# EAGLE design ElectronPhotonTopBoard (EAGLE 7.4.0)
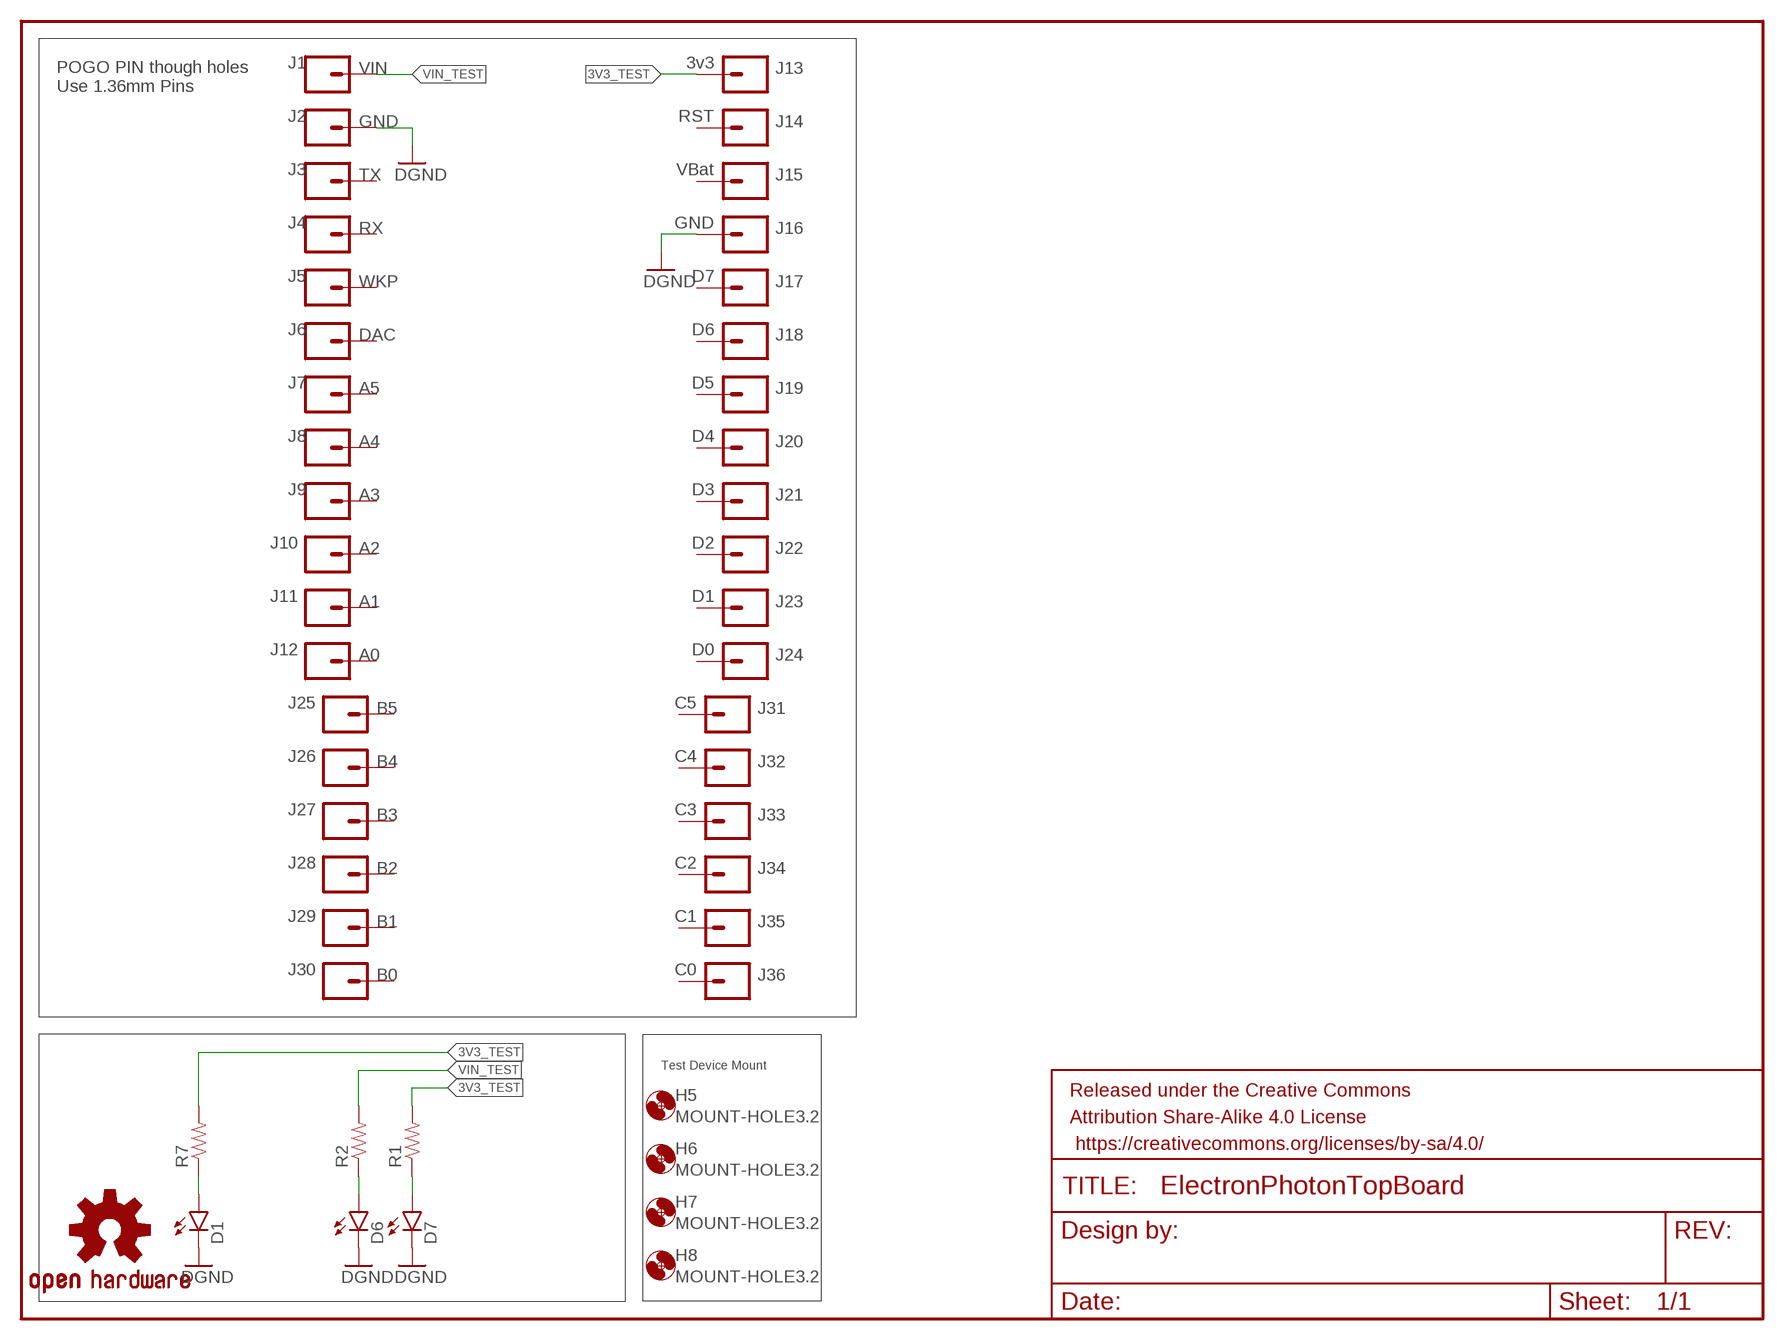
[diagram p0: schematic, sheet 1]

## Parts
D1  LED1206-BOTTOM  [LED-1206-BOTTOM]
D6  LED1206-BOTTOM  [LED-1206-BOTTOM]
D7  LED1206-BOTTOM  [LED-1206-BOTTOM]
FRAME1  FRAME-LETTER  [CREATIVE_COMMONS]
H5  MOUNT-HOLE3.2  [3,2]
H6  MOUNT-HOLE3.2  [3,2]
H7  MOUNT-HOLE3.2  [3,2]
H8  MOUNT-HOLE3.2  [3,2]
J1  VIN  M01-CUSTOMPOGOPIN_HOLE_1.4  [1X01_POGOPIN_HOLE_1.4]
J2  GND  M01-CUSTOMPOGOPIN_HOLE_1.4  [1X01_POGOPIN_HOLE_1.4]
J3  TX  M01-CUSTOMPOGOPIN_HOLE_1.4  [1X01_POGOPIN_HOLE_1.4]
J4  RX  M01-CUSTOMPOGOPIN_HOLE_1.4  [1X01_POGOPIN_HOLE_1.4]
J5  WKP  M01-CUSTOMPOGOPIN_HOLE_1.4  [1X01_POGOPIN_HOLE_1.4]
J6  DAC  M01-CUSTOMPOGOPIN_HOLE_1.4  [1X01_POGOPIN_HOLE_1.4]
J7  A5  M01-CUSTOMPOGOPIN_HOLE_1.4  [1X01_POGOPIN_HOLE_1.4]
J8  A4  M01-CUSTOMPOGOPIN_HOLE_1.4  [1X01_POGOPIN_HOLE_1.4]
J9  A3  M01-CUSTOMPOGOPIN_HOLE_1.4  [1X01_POGOPIN_HOLE_1.4]
J10  A2  M01-CUSTOMPOGOPIN_HOLE_1.4  [1X01_POGOPIN_HOLE_1.4]
J11  A1  M01-CUSTOMPOGOPIN_HOLE_1.4  [1X01_POGOPIN_HOLE_1.4]
J12  A0  M01-CUSTOMPOGOPIN_HOLE_1.4  [1X01_POGOPIN_HOLE_1.4]
J13  3v3  M01-CUSTOMPOGOPIN_HOLE_1.4  [1X01_POGOPIN_HOLE_1.4]
J14  RST  M01-CUSTOMPOGOPIN_HOLE_1.4  [1X01_POGOPIN_HOLE_1.4]
J15  VBat  M01-CUSTOMPOGOPIN_HOLE_1.4  [1X01_POGOPIN_HOLE_1.4]
J16  GND  M01-CUSTOMPOGOPIN_HOLE_1.4  [1X01_POGOPIN_HOLE_1.4]
J17  D7  M01-CUSTOMPOGOPIN_HOLE_1.4  [1X01_POGOPIN_HOLE_1.4]
J18  D6  M01-CUSTOMPOGOPIN_HOLE_1.4  [1X01_POGOPIN_HOLE_1.4]
J19  D5  M01-CUSTOMPOGOPIN_HOLE_1.4  [1X01_POGOPIN_HOLE_1.4]
J20  D4  M01-CUSTOMPOGOPIN_HOLE_1.4  [1X01_POGOPIN_HOLE_1.4]
J21  D3  M01-CUSTOMPOGOPIN_HOLE_1.4  [1X01_POGOPIN_HOLE_1.4]
J22  D2  M01-CUSTOMPOGOPIN_HOLE_1.4  [1X01_POGOPIN_HOLE_1.4]
J23  D1  M01-CUSTOMPOGOPIN_HOLE_1.4  [1X01_POGOPIN_HOLE_1.4]
J24  D0  M01-CUSTOMPOGOPIN_HOLE_1.4  [1X01_POGOPIN_HOLE_1.4]
J25  B5  M01-CUSTOMPOGOPIN_HOLE_1.4  [1X01_POGOPIN_HOLE_1.4]
J26  B4  M01-CUSTOMPOGOPIN_HOLE_1.4  [1X01_POGOPIN_HOLE_1.4]
J27  B3  M01-CUSTOMPOGOPIN_HOLE_1.4  [1X01_POGOPIN_HOLE_1.4]
J28  B2  M01-CUSTOMPOGOPIN_HOLE_1.4  [1X01_POGOPIN_HOLE_1.4]
J29  B1  M01-CUSTOMPOGOPIN_HOLE_1.4  [1X01_POGOPIN_HOLE_1.4]
J30  B0  M01-CUSTOMPOGOPIN_HOLE_1.4  [1X01_POGOPIN_HOLE_1.4]
J31  C5  M01-CUSTOMPOGOPIN_HOLE_1.4  [1X01_POGOPIN_HOLE_1.4]
J32  C4  M01-CUSTOMPOGOPIN_HOLE_1.4  [1X01_POGOPIN_HOLE_1.4]
J33  C3  M01-CUSTOMPOGOPIN_HOLE_1.4  [1X01_POGOPIN_HOLE_1.4]
J34  C2  M01-CUSTOMPOGOPIN_HOLE_1.4  [1X01_POGOPIN_HOLE_1.4]
J35  C1  M01-CUSTOMPOGOPIN_HOLE_1.4  [1X01_POGOPIN_HOLE_1.4]
J36  C0  M01-CUSTOMPOGOPIN_HOLE_1.4  [1X01_POGOPIN_HOLE_1.4]
LOGO1  OSHW-LOGOL  [OSHW-LOGO-L]
R1  RESISTOR1206  [1206]
R2  RESISTOR1206  [1206]
R7  RESISTOR1206  [1206]

## Nets
3V3_TEST: J13.1 R1.2 R7.2
GND: D1.C D6.C D7.C J2.1 J16.1 ; supply symbol labelled DGND
N$13: D1.A R7.1
N$18: D6.A R2.1
N$19: D7.A R1.1
VIN_TEST: J1.1 R2.2
Unconnected: J3.1 J4.1 J5.1 J6.1 J7.1 J8.1 J9.1 J10.1 J11.1 J12.1 J14.1 J15.1 J17.1 J18.1 J19.1 J20.1 J21.1 J22.1 J23.1 J24.1 J25.1 J26.1 J27.1 J28.1 J29.1 J30.1 J31.1 J32.1 J33.1 J34.1 J35.1 J36.1

## Notes on the sheet
- POGO PIN though holes
  Use 1.36mm Pins
- Test Device Mount

## Library data of the parts
D1 D6 D7 = SparkFun-LED:LED: LEDs Standard schematic elements and footprints for 5mm, 3mm, 1206, and 0603 sized LEDs. 5mm - Spark Fun Electronics SKU : COM-00529 (and others)
FRAME1 = SparkFun-Aesthetics:FRAME-LETTER: Schematic Frame Standard 8.5x11 US Letter frame
H5-H8 = holes:MOUNT-HOLE: MOUNTING HOLE with drill center marker
J1-J36 = Tinamous:M01-CUSTOM: Header 1 Standard 1-pin 0.1" header. Use with straight break away headers (SKU : PRT-00116), right angle break away headers (PRT-00553), swiss pins (PRT-00743), machine pins (PRT-00117), and female headers (PRT-00115). SMTSO-256-ET is a "flush mount" nut for a 4-40 screw. The older package used to be too tight, and did not allow it to sit properly thru the drill hit. The latest (0.165DIA) fits nice and snug.
LOGO1 = SparkFun-Aesthetics:OSHW-LOGO: Open Source Hardware Logo This logo indicates the piece of hardware it is found on incorporates a OSHW license and/or adheres to the definition of open source hardware found here: http://freedomdefined.org/OSHW
R1 R2 R7 = SparkFun-Resistors:RESISTOR: Resistor Basic schematic elements and footprints for 0603, 1206, and PTH resistors.

## Board
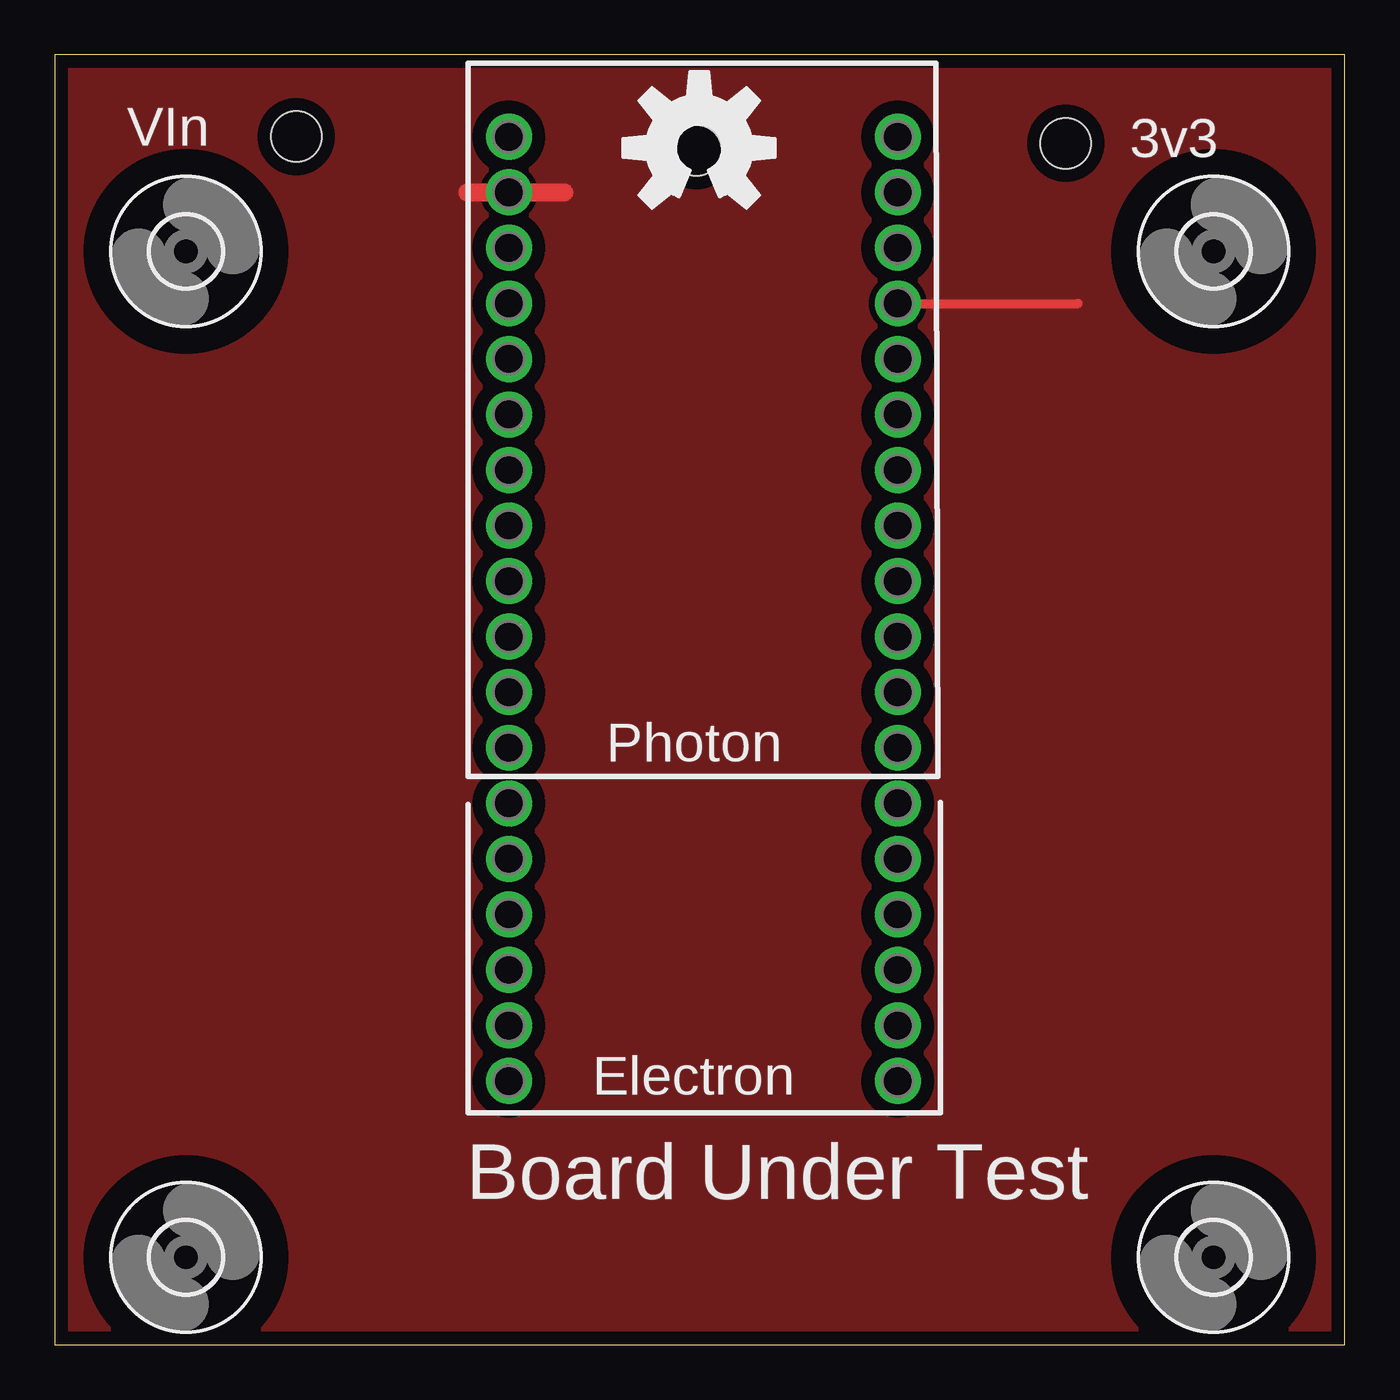
[diagram p1: board, top side]
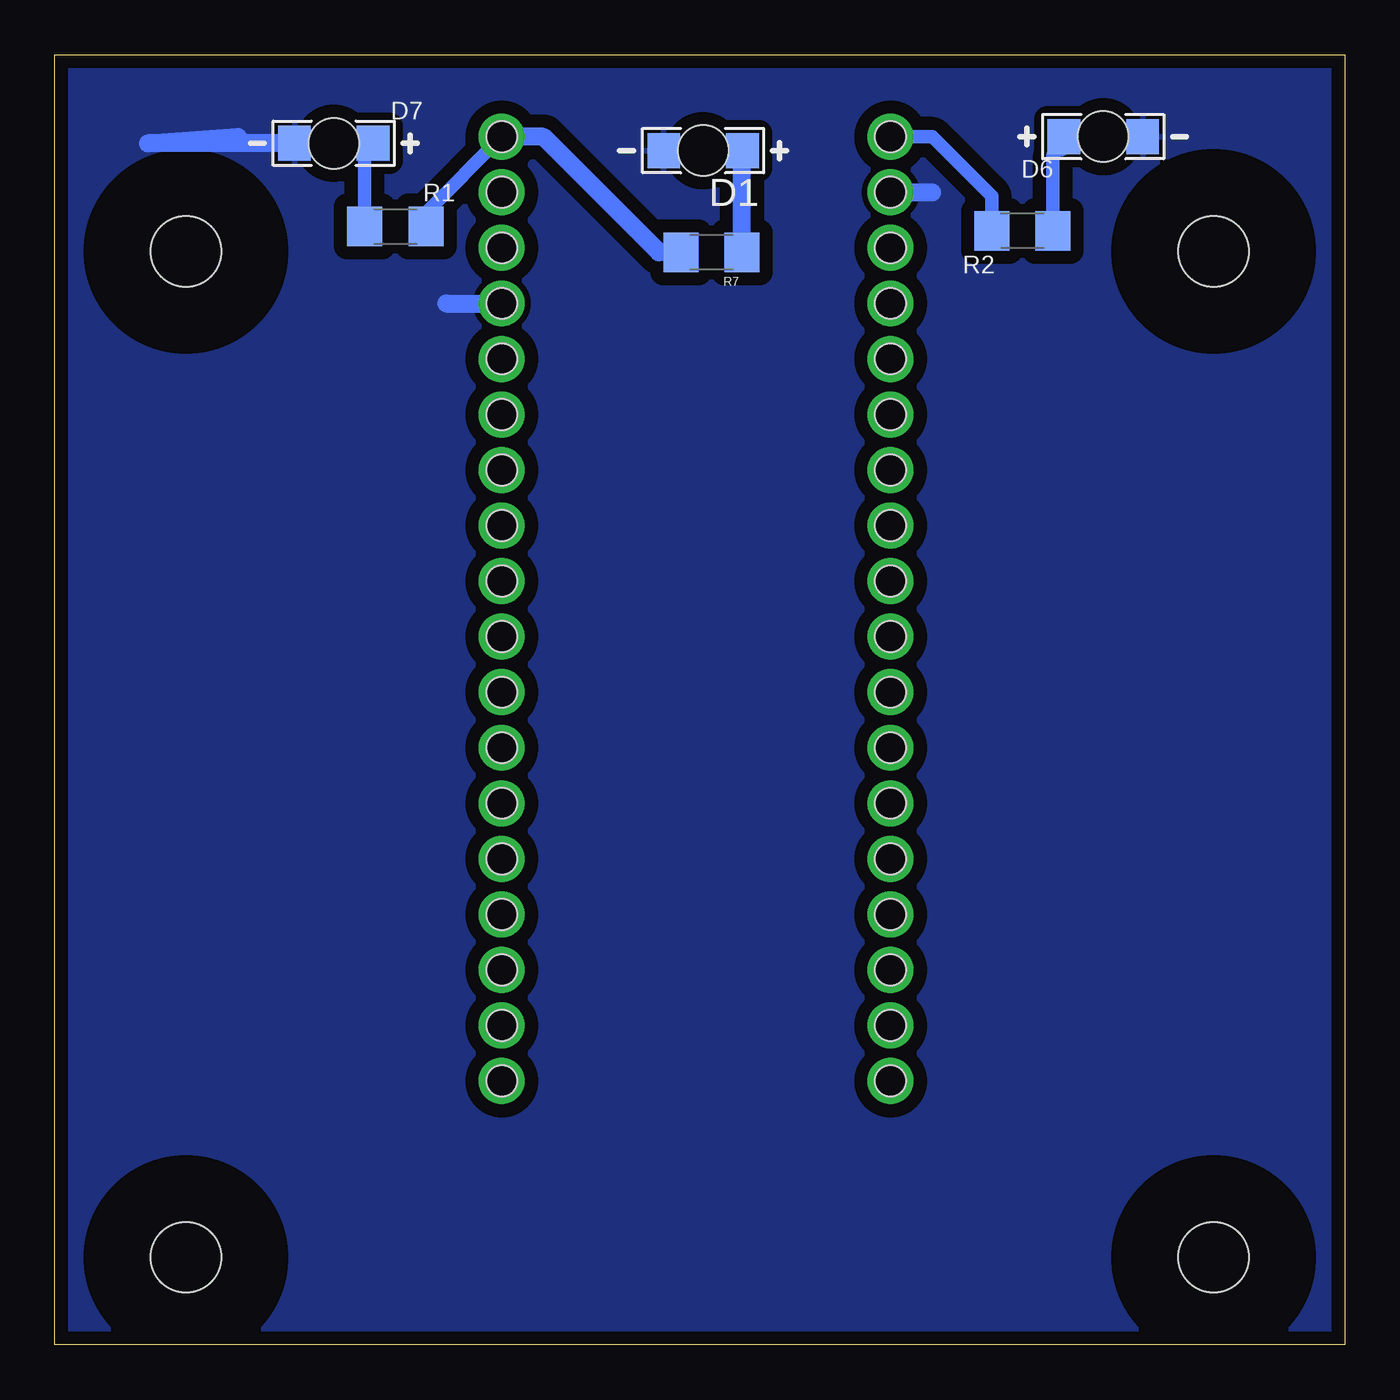
[diagram p2: board, bottom side, seen from below]

Size 59 x 59 mm. Coordinates in mm from the lower left corner, seen from the top.
Outline: 0,0 59,0 59,59 0,59 0,0
Copper layers (1*16): Top 0.035mm / dielectric 1.5mm / Bottom 0.035mm
Design rules "dirt_cheap_dirty_boards.v1": minimum track width 5mil, minimum drill 12mil, track to track 5mil, track to pad 5mil, pad to pad 5mil, via to via 5mil, smd to smd 0mil, copper to edge 10mil, drill to drill 10mil, minimum pad ring 10mil, minimum via ring 6mil, stop-mask expansion 2mil, vias tented up to drill 25mil, thermal gap 10mil
Holes 1.4 mm at 20.77,50.16

### Footprints (pad centres in the part's own frame; a part is rotated, then mirrored left to right if it is on the bottom)
LED-1206-BOTTOM = smd 1.5 x 1.6: A -1.8,0; C 1.8,0 | hole 2.3: 0,0
3,2 = hole 3.2: 0,0
1X01_POGOPIN_HOLE_1.4 = drill 1.4 pad 1.676: 1 0,0 | hole 1.4: 0,0
1206 = smd 1.6 x 1.8: 1 -1.4,0; 2 1.4,0

### Placement (x,y rotation side)
D1  29.35,54.61 180 bottom
D6  11.05,55.26 0 bottom
D7  46.23,54.95 180 bottom
FRAME1  -2.74,-13.02 0 top  (outside the outline)
H5  53,50 0 top
H6  6,50 0 top
H7  6,4 0 top
H8  53,4 0 top
J1  20.77,55.24 0 top
J2  20.77,52.7 0 top
J3  20.77,50.16 0 top
J4  20.77,47.62 0 top
J5  20.77,45.09 0 top
J6  20.77,42.55 0 top
J7  20.77,40.01 0 top
J8  20.77,37.47 0 top
J9  20.77,34.92 0 top
J10  20.77,32.38 0 top
J11  20.77,29.84 0 top
J12  20.77,27.3 0 top
J13  38.55,55.24 0 top
J14  38.55,52.7 0 top
J15  38.55,50.16 0 top
J16  38.55,47.62 0 top
J17  38.55,45.09 0 top
J18  38.55,42.55 0 top
J19  38.55,40.01 0 top
J20  38.55,37.47 0 top
J21  38.55,34.92 0 top
J22  38.55,32.38 0 top
J23  38.55,29.84 0 top
J24  38.55,27.3 0 top
J25  20.77,24.77 0 top
J26  20.77,22.23 0 top
J27  20.77,19.68 0 top
J28  20.77,17.14 0 top
J29  20.77,14.61 0 top
J30  20.77,12.06 0 top
J31  38.55,24.77 0 top
J32  38.55,22.23 0 top
J33  38.55,19.68 0 top
J34  38.55,17.14 0 top
J35  38.55,14.61 0 top
J36  38.55,12.06 0 top
LOGO1  29.48,54.73 0 top
R1  43.42,51.14 0 bottom
R2  14.74,50.95 180 bottom
R7  28.96,49.96 180 bottom

### Tracks (layer width: path | path; a pad name or v marks a point on that pad's centre or on a via)
3V3_TEST
  Bottom 0.61: R1.2 42.02,51.77 J13.1
  Bottom 0.813: R7.2 31.37,49.96 36.65,55.24 J13.1
GND
  Top 0.406: J16.1 46.81,47.62
  Top 0.813: 18.87,52.7 23.31,52.7
  Bottom 0.813: D7.C 54.72,54.95 50.62,55.24 | 41.09,47.62 J16.1 | J2.1 18.87,52.7
  pour Bottom (isolate 0.61, rank 5): -0.32,59.27 59.38,59.27 59.28,-0.34 -0.25,-0.25
  pour Top (isolate 0.61, rank 5): -0.57,59.56 59.76,59.55 59.75,0.5 59.75,-1 -0.75,-0.75
N$13
  Bottom 0.813: R7.1 27.56,54.6 D1.A
N$18
  Bottom 0.61: R2.1 13.34,54.4 12.98,54.76
  Bottom 0.813: 12.98,54.76 D6.A
N$19
  Bottom 0.61: R1.1 44.83,54.56 D7.A
VIN_TEST
  Bottom 0.61: R2.2 16.14,52.52 18.87,55.24 J1.1
  Bottom 0.813: J1.1 20.14,55.24

### Text on the board
tNames: VIn | 3v3 | Photon | Electron | Board Under Test